# Altium project USB_Hub_Breakout_V3.PrjPcb
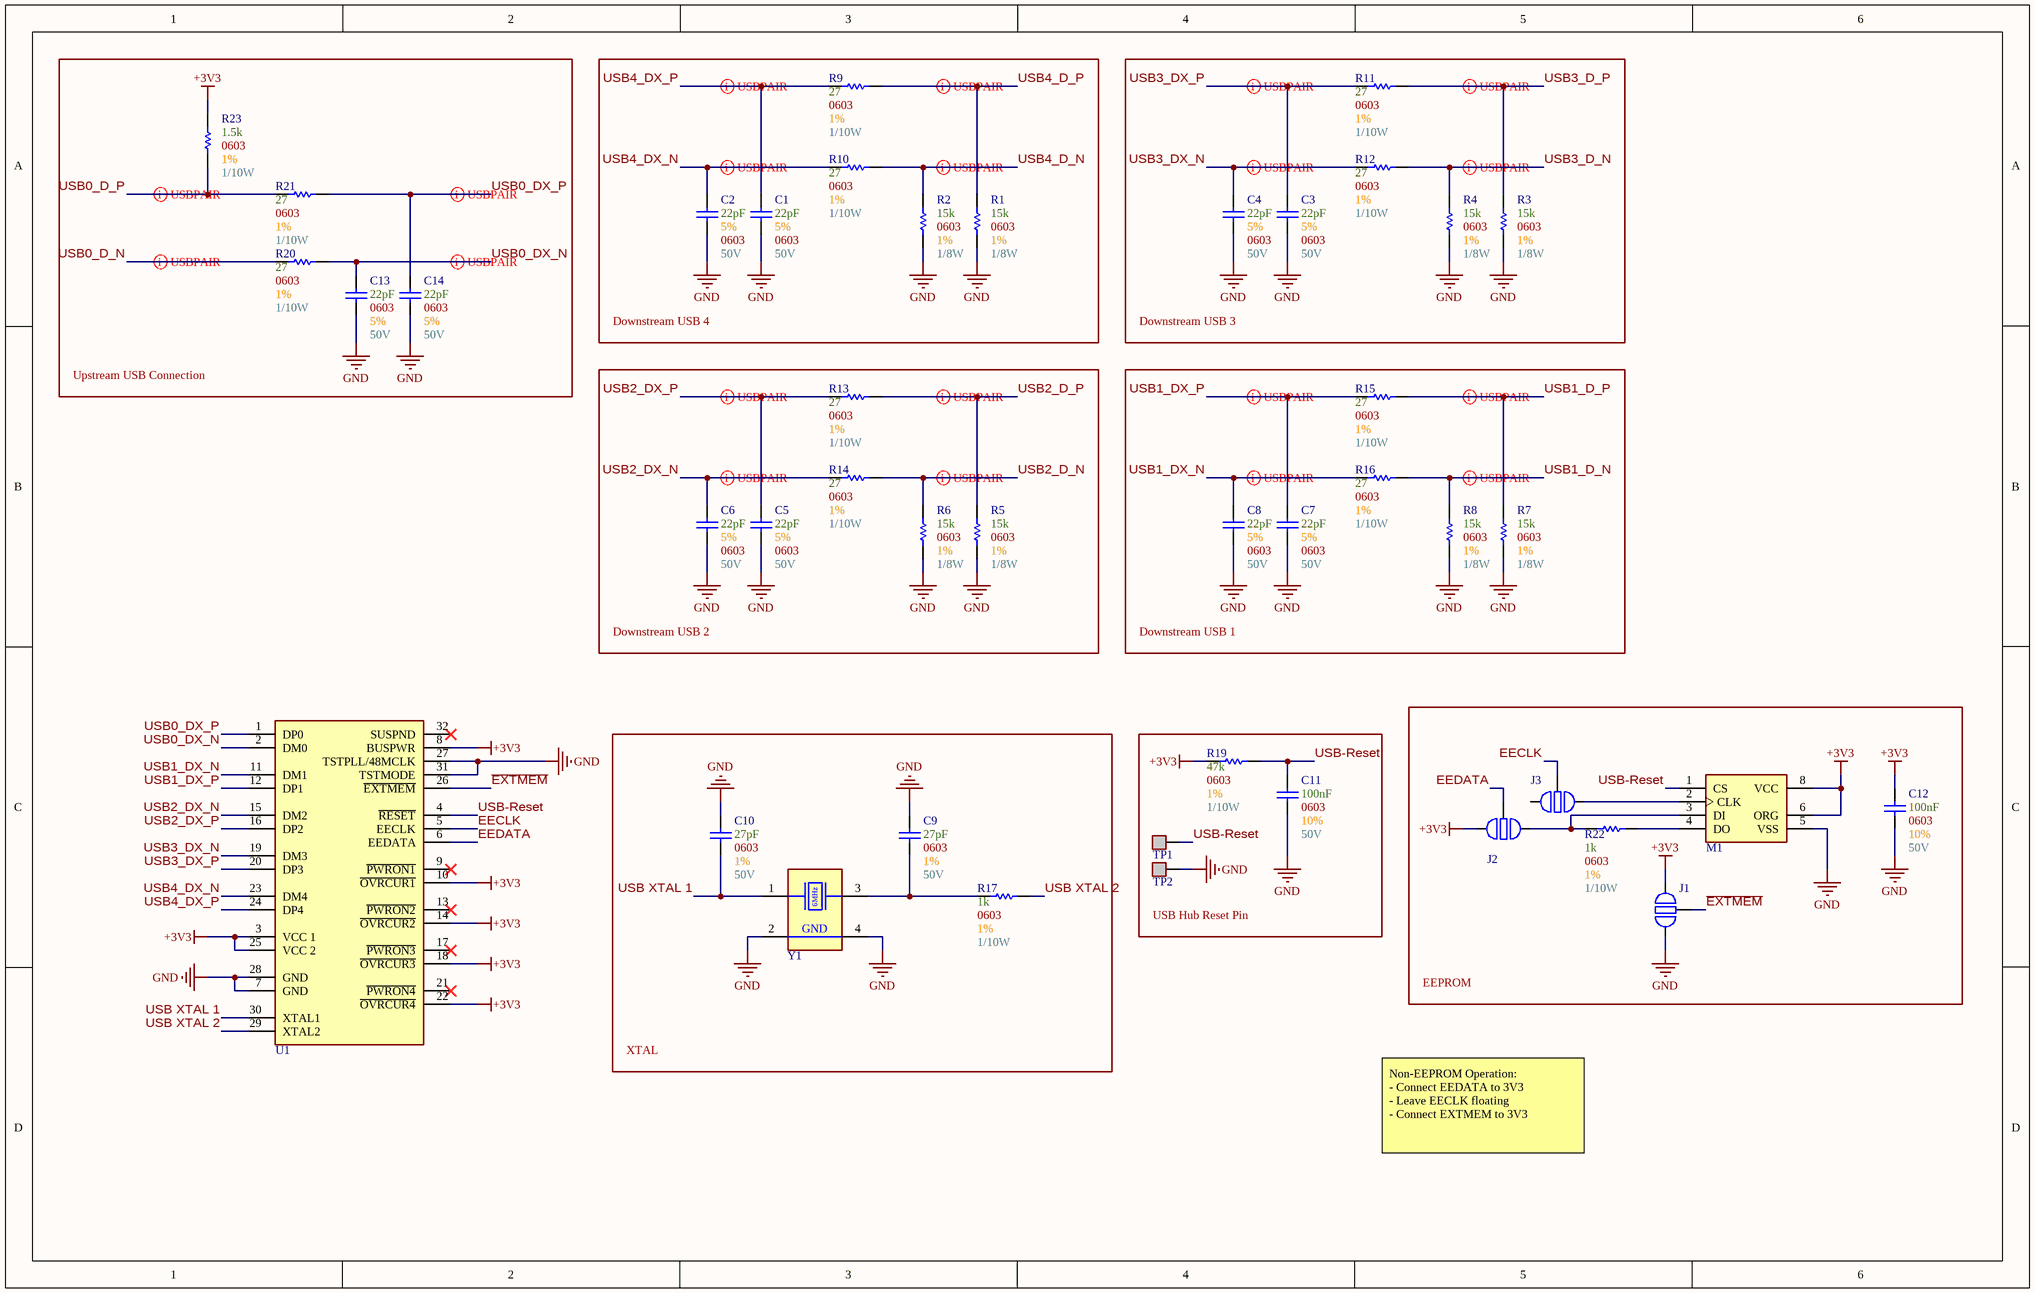
[diagram p0: USB Hub.SchDoc]
3 sheets, 60 parts. Net scope: global (net labels, ports and power ports of the same name join across sheets).
Board file: Layout.PcbDoc
Sheets:
  USB Hub.SchDoc
  Connectors.SchDoc
  Power.SchDoc

## Sheet USB Hub.SchDoc
size B; SheetNumber: 1; SheetTotal: 3

### Parts
C1  Max Voltage: 50V  Size Package: 0603  Tolerance: 5%  Capacitance: 22pF  [[Cap] SMD 0603]  (hidden comment: [Cap] 0603 22pF 5% 50V)
C2  Max Voltage: 50V  Size Package: 0603  Tolerance: 5%  Capacitance: 22pF  [[Cap] SMD 0603]  (hidden comment: [Cap] 0603 22pF 5% 50V)
C3  Max Voltage: 50V  Size Package: 0603  Tolerance: 5%  Capacitance: 22pF  [[Cap] SMD 0603]  (hidden comment: [Cap] 0603 22pF 5% 50V)
C4  Max Voltage: 50V  Size Package: 0603  Tolerance: 5%  Capacitance: 22pF  [[Cap] SMD 0603]  (hidden comment: [Cap] 0603 22pF 5% 50V)
C5  Max Voltage: 50V  Size Package: 0603  Tolerance: 5%  Capacitance: 22pF  [[Cap] SMD 0603]  (hidden comment: [Cap] 0603 22pF 5% 50V)
C6  Max Voltage: 50V  Size Package: 0603  Tolerance: 5%  Capacitance: 22pF  [[Cap] SMD 0603]  (hidden comment: [Cap] 0603 22pF 5% 50V)
C7  Max Voltage: 50V  Size Package: 0603  Tolerance: 5%  Capacitance: 22pF  [[Cap] SMD 0603]  (hidden comment: [Cap] 0603 22pF 5% 50V)
C8  Max Voltage: 50V  Size Package: 0603  Tolerance: 5%  Capacitance: 22pF  [[Cap] SMD 0603]  (hidden comment: [Cap] 0603 22pF 5% 50V)
C9  Max Voltage: 50V  Size Package: 0603  Tolerance: 1%  Capacitance: 27pF  [[Cap] SMD 0603]  (hidden comment: [Cap] 0603 27pF 1% 50V)
C10  Max Voltage: 50V  Size Package: 0603  Tolerance: 1%  Capacitance: 27pF  [[Cap] SMD 0603]  (hidden comment: [Cap] 0603 27pF 1% 50V)
C11  Max Voltage: 50V  Size Package: 0603  Tolerance: 10%  Capacitance: 100nF  [[Cap] SMD 0603]  (hidden comment: [Cap] 0603 0.1uF 10% 50V)
C12  Max Voltage: 50V  Size Package: 0603  Tolerance: 10%  Capacitance: 100nF  [[Cap] SMD 0603]  (hidden comment: [Cap] 0603 0.1uF 10% 50V)
C13  Max Voltage: 50V  Size Package: 0603  Tolerance: 5%  Capacitance: 22pF  [[Cap] SMD 0603]  (hidden comment: [Cap] 0603 22pF 5% 50V)
C14  Max Voltage: 50V  Size Package: 0603  Tolerance: 5%  Capacitance: 22pF  [[Cap] SMD 0603]  (hidden comment: [Cap] 0603 22pF 5% 50V)
J1  [Jumper] Thru-Hole 3pin  [[Jumper] Thru-Hole 3pin]  (value not drawn)  (no BOM)
J2  [Jumper] Thru-Hole 3pin  [[Jumper] Thru-Hole 3pin]  (value not drawn)  (no BOM)
J3  [Jumper] Thru-Hole 3pin  [[Jumper] Thru-Hole 3pin]  (value not drawn)  (no BOM)
M1  [Flash] 32x16b  [[Flash] 32x16b]  (value not drawn)
R1  Wattage: 1/8W  Tolerance: 1%  Resistance: 15k  Size Package: 0603  [[Res] SMD 0603]  (hidden comment: [15k] SMD 0603 1% 1/8W)
R2  Wattage: 1/8W  Tolerance: 1%  Resistance: 15k  Size Package: 0603  [[Res] SMD 0603]  (hidden comment: [15k] SMD 0603 1% 1/8W)
R3  Wattage: 1/8W  Tolerance: 1%  Resistance: 15k  Size Package: 0603  [[Res] SMD 0603]  (hidden comment: [15k] SMD 0603 1% 1/8W)
R4  Wattage: 1/8W  Tolerance: 1%  Resistance: 15k  Size Package: 0603  [[Res] SMD 0603]  (hidden comment: [15k] SMD 0603 1% 1/8W)
R5  Wattage: 1/8W  Tolerance: 1%  Resistance: 15k  Size Package: 0603  [[Res] SMD 0603]  (hidden comment: [15k] SMD 0603 1% 1/8W)
R6  Wattage: 1/8W  Tolerance: 1%  Resistance: 15k  Size Package: 0603  [[Res] SMD 0603]  (hidden comment: [15k] SMD 0603 1% 1/8W)
R7  Wattage: 1/8W  Tolerance: 1%  Resistance: 15k  Size Package: 0603  [[Res] SMD 0603]  (hidden comment: [15k] SMD 0603 1% 1/8W)
R8  Wattage: 1/8W  Tolerance: 1%  Resistance: 15k  Size Package: 0603  [[Res] SMD 0603]  (hidden comment: [15k] SMD 0603 1% 1/8W)
R9  Wattage: 1/10W  Tolerance: 1%  Resistance: 27  Size Package: 0603  [[Res] SMD 0603]  (hidden comment: [27] SMD 0603 1% 1/10W)
R10  Wattage: 1/10W  Tolerance: 1%  Resistance: 27  Size Package: 0603  [[Res] SMD 0603]  (hidden comment: [27] SMD 0603 1% 1/10W)
R11  Wattage: 1/10W  Tolerance: 1%  Resistance: 27  Size Package: 0603  [[Res] SMD 0603]  (hidden comment: [27] SMD 0603 1% 1/10W)
R12  Wattage: 1/10W  Tolerance: 1%  Resistance: 27  Size Package: 0603  [[Res] SMD 0603]  (hidden comment: [27] SMD 0603 1% 1/10W)
R13  Wattage: 1/10W  Tolerance: 1%  Resistance: 27  Size Package: 0603  [[Res] SMD 0603]  (hidden comment: [27] SMD 0603 1% 1/10W)
R14  Wattage: 1/10W  Tolerance: 1%  Resistance: 27  Size Package: 0603  [[Res] SMD 0603]  (hidden comment: [27] SMD 0603 1% 1/10W)
R15  Wattage: 1/10W  Tolerance: 1%  Resistance: 27  Size Package: 0603  [[Res] SMD 0603]  (hidden comment: [27] SMD 0603 1% 1/10W)
R16  Wattage: 1/10W  Tolerance: 1%  Resistance: 27  Size Package: 0603  [[Res] SMD 0603]  (hidden comment: [27] SMD 0603 1% 1/10W)
R17  Wattage: 1/10W  Tolerance: 1%  Resistance: 1k  Size Package: 0603  [[Res] SMD 0603]  (hidden comment: [1k] SMD 0603 1% 1/10W)
R19  Wattage: 1/10W  Tolerance: 1%  Resistance: 47k  Size Package: 0603  [[Res] SMD 0603]  (hidden comment: [47k] SMD 0603 1% 1/10W)
R20  Wattage: 1/10W  Tolerance: 1%  Resistance: 27  Size Package: 0603  [[Res] SMD 0603]  (hidden comment: [27] SMD 0603 1% 1/10W)
R21  Wattage: 1/10W  Tolerance: 1%  Resistance: 27  Size Package: 0603  [[Res] SMD 0603]  (hidden comment: [27] SMD 0603 1% 1/10W)
R22  Wattage: 1/10W  Tolerance: 1%  Resistance: 1k  Size Package: 0603  [[Res] SMD 0603]  (hidden comment: [1k] SMD 0603 1% 1/10W)
R23  Wattage: 1/10W  Tolerance: 1%  Resistance: 1.5k  Size Package: 0603  [[Res] SMD 0603]  (hidden comment: [1.5k] SMD 0603 1% 1/10W)
TP1  [THM] Thru-Hole  [[THM] White]  (value not drawn)
TP2  [THM] Thru-Hole  [[THM] White]  (value not drawn)
U1  4port  [[USB Hub] USB2.0 4port]  (value not drawn)
Y1  [Crystal] SMD 6MHz  [[Crystal] SMD 6MHz]  (value not drawn)

### Blocks framed on the sheet
Upstream USB Connection: C13 C14 R20 R21 R23
Downstream USB 4: C1 C2 R1 R2 R9 R10
Downstream USB 3: C3 C4 R3 R4 R11 R12
Downstream USB 2: C5 C6 R5 R6 R13 R14
Downstream USB 1: C7 C8 R7 R8 R15 R16
EEPROM: C12 J1-J3 M1 R22
XTAL: C9 C10 R17 Y1
USB Hub Reset Pin: C11 R19 TP1 TP2

### Nets
+3V3: C12.2 J1.3 J2.3 M1.6(ORG) M1.8(VCC) R19.1 R23.2 U1.3(VCC_1) U1.8(BUSPWR) U1.10(~{OVRCUR1}) U1.14(~{OVRCUR2}) U1.18(~{OVRCUR3}) U1.22(~{OVRCUR4}) U1.25(VCC_2)
GND: C1.1 C2.1 C3.1 C4.1 C5.1 C6.1 C7.1 C8.1 C9.1 C10.1 C11.1 C12.1 C13.1 C14.1 J1.1 M1.5(VSS) R1.1 R2.1 R3.1 R4.1 R5.1 R6.1 R7.1 R8.1 TP2.1 U1.7(GND) U1.27(TSTPLL/48MCLK) U1.28(GND) U1.31(TSTMODE) Y1.2(GND) Y1.4(GND)
~{EXTMEM}: J1.2(Common) U1.26(~{EXTMEM})
EECLK: J3.2(Common) U1.5(EECLK)
EEDATA: J2.2(Common) U1.6(EEDATA)
USB0_D_N: R20.1
USB0_D_P: R21.1 R23.1
USB0_DX_N: C13.2 R20.2 U1.2(DM0)
USB0_DX_P: C14.2 R21.2 U1.1(DP0)
USB1_D_N: R8.2 R16.2
USB1_D_P: R7.2 R15.2
USB1_DX_N: C8.2 R16.1 U1.11(DM1)
USB1_DX_P: C7.2 R15.1 U1.12(DP1)
USB2_D_N: R6.2 R14.2
USB2_D_P: R5.2 R13.2
USB2_DX_N: C6.2 R14.1 U1.15(DM2)
USB2_DX_P: C5.2 R13.1 U1.16(DP2)
USB3_D_N: R4.2 R12.2
USB3_D_P: R3.2 R11.2
USB3_DX_N: C4.2 R12.1 U1.19(DM3)
USB3_DX_P: C3.2 R11.1 U1.20(DP3)
USB4_D_N: R2.2 R10.2
USB4_D_P: R1.2 R9.2
USB4_DX_N: C2.2 R10.1 U1.23(DM4)
USB4_DX_P: C1.2 R9.1 U1.24(DP4)
USB XTAL 1: C10.2 U1.30(XTAL1) Y1.1(XTAL1)
USB XTAL 2: R17.2 U1.29(XTAL2)
USB-Reset: C11.2 M1.1(CS) R19.2 TP1.1 U1.4(~{RESET})
NetC9_2: C9.2 R17.1 Y1.3(XTAL2)
NetJ2_1: J2.1 M1.3(DI) R22.2
NetJ3_1: J3.1 M1.2(CLK)
NetM1_4: M1.4(DO) R22.1

Not connected (* = marked no-connect by the designer): J3 3; U1 9(~{PWRON1})* 13(~{PWRON2})* 17(~{PWRON3})* 21(~{PWRON4})* 32(SUSPND)*

### Layout directives
differential pair; differential pair class USB_Pairs: USB0_D_N, USB0_D_P, USB0_DX_N, USB0_DX_P, USB1_D_N, USB1_D_P, USB1_DX_N, USB1_DX_P, USB2_D_N, USB2_D_P, USB2_DX_N, USB2_DX_P, USB3_D_N, USB3_D_P, USB3_DX_N, USB3_DX_P, USB4_D_N, USB4_D_P, USB4_DX_N, USB4_DX_P

### Notes on the sheet
- Non-EEPROM Operation:
  - Connect EEDATA to 3V3
  - Leave EECLK floating
  - Connect EXTMEM to 3V3
- (in symbol [Crystal] SMD 6MHz) 6MHz

### Library data of the parts
C1-C8 C13 C14 = [Cap] 0603 22pF 5% 50V: CC0603JRNPO9BN240; Supplier 1: DigiKey; Supplier Part Number 1: 311-1062-1-ND
C9 C10 = [Cap] 0603 27pF 1% 50V: 0603N270F500CT; Supplier 1: DigiKey; Supplier Part Number 1: 1292-1510-1-ND
C11 C12 = [Cap] 0603 0.1uF 10% 50V: CL10B104KB8NNNC; Supplier 1: DigiKey; Supplier Part Number 1: 1276-1000-6-ND
M1 = [Flash] 32x16b: M93C46-WMN6TP; Supplier 1: DigiKey; Supplier Part Number 1: 497-5090-1-ND
R1-R8 = [15k] SMD 0603 1% 1/8W: CRCW060315K0FKEA; Supplier 1: DigiKey; Supplier Part Number 1: 541-15.0KHCT-ND
R9-R16 R20 R21 = [27] SMD 0603 1% 1/10W: MCT06030C2709FP500; Supplier 1: DigiKey; Supplier Part Number 1: 749-1631-1-ND
R17 R22 = [1k] SMD 0603 1% 1/10W: RMCF0603FT1K00; Supplier 1: DigiKey; Supplier Part Number 1: RMCF0603FT1K00DKR-ND
R19 = [47k] SMD 0603 1% 1/10W: RC0603FR-0747KL; Supplier 1: DigiKey; Supplier Part Number 1: 311-47.0KHRDKR-ND
R23 = [1.5k] SMD 0603 1% 1/10W: CR0603-FX-1501ELF; Supplier 1: DigiKey; Supplier Part Number 1: 118-CR0603-FX-1501ELFCT-ND
TP1 TP2 = [THM] Thru-Hole: 5012; Supplier 1: DigiKey; Supplier Part Number 1: 36-5012-ND
U1 = [USB Hub] USB 2.0 4port: TUSB2046BVFR; Supplier 1: DigiKey; Supplier Part Number 1: 296-27131-1-ND
Y1 = [Crystal] SMD 6MHz: ECS-060-18-20BM-JEN-TR; Supplier 1: DigiKey; Supplier Part Number 1: XC2349DKR-ND

## Sheet Connectors.SchDoc
size A; SheetNumber: 2; SheetTotal: 3
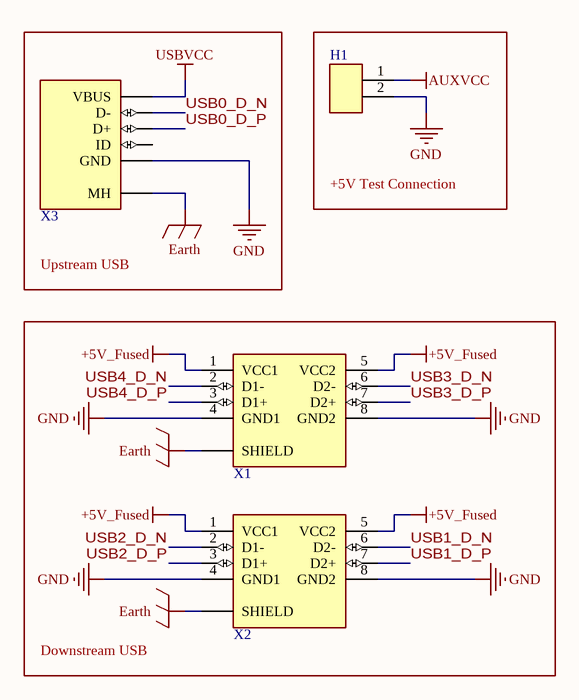
[diagram p1: Connectors.SchDoc]

### Parts
H1  1x2 Header  [[Header] 1x2 Male]  (value not drawn)
X1  USB-A  [[USB] Type-A Dual]  (value not drawn)
X2  USB-A  [[USB] Type-A Dual]  (value not drawn)
X3  [USB] Type-B Mini  [[USB] Type-B Mini]  (value not drawn)

### Blocks framed on the sheet
Upstream USB: X3
+5V Test Connection: H1
Downstream USB: X1 X2

### Nets
+5V_Fused: X1.1(VCC1) X1.5(VCC2) X2.1(VCC1) X2.5(VCC2)
AUXVCC: H1.1
Earth: X1.MH(SHIELD) X2.MH(SHIELD) X3.MH
GND: H1.2 X1.4(GND1) X1.8(GND2) X2.4(GND1) X2.8(GND2) X3.5(GND)
USBVCC: X3.1(VBUS)
USB0_D_N: X3.2(D-)
USB0_D_P: X3.3(D+)
USB1_D_N: X2.6(D2-)
USB1_D_P: X2.7(D2+)
USB2_D_N: X2.2(D1-)
USB2_D_P: X2.3(D1+)
USB3_D_N: X1.6(D2-)
USB3_D_P: X1.7(D2+)
USB4_D_N: X1.2(D1-)
USB4_D_P: X1.3(D1+)

Not connected (* = marked no-connect by the designer): X3 4(ID)

### Library data of the parts
H1 = [Header] 1x2 Male: 2.54mm pitch
X1 X2 = [USB] Type-A Dual: 61400826021; Supplier 1: DigiKey; Supplier Part Number 1: 2092-KUSBX-AS2N-B-ND
X3 = [USB] Type-B Mini: MUSB-05-S-B-SM-A-K-TR; Supplier 1: DigiKey; Supplier Part Number 1: SAM14226CT-ND

## Sheet Power.SchDoc
size A; SheetNumber: 3; SheetTotal: 3
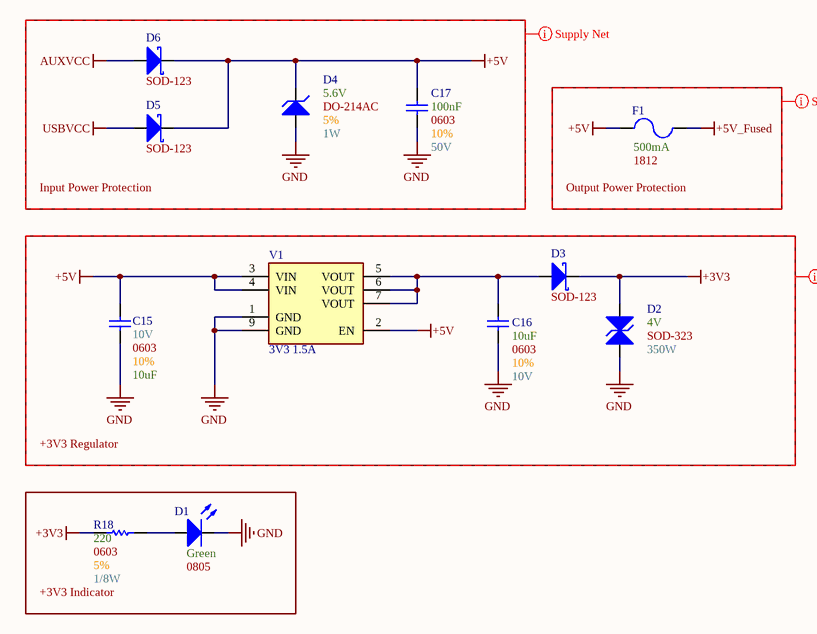
[diagram p2: Power.SchDoc]

### Parts
C15  Max Voltage: 10V  Size Package: 0603  Tolerance: 10%  Capacitance: 10uF  [[Cap] SMD 0603]  (hidden comment: [Cap] 0603 10uF 10% 10V)
C16  Max Voltage: 10V  Size Package: 0603  Tolerance: 10%  Capacitance: 10uF  [[Cap] SMD 0603]  (hidden comment: [Cap] 0603 10uF 10% 10V)
C17  Max Voltage: 50V  Size Package: 0603  Tolerance: 10%  Capacitance: 100nF  [[Cap] SMD 0603]  (hidden comment: [Cap] 0603 0.1uF 10% 50V)
D1  Color: Green  Size Package: 0805  [[LED] SMD 0805]  (hidden comment: [LED] SMD 0805 Green)
D2  Wattage: 350W  Optimal Zener Voltage: 4V  [[Diode] SOD-323]  (hidden comment: SOD-323)
D3  Footprint: SOD-123  [[Diode] SMD SOD-123]  (hidden comment: SOD123)
D4  Tolerance: 5%  Wattage: 1W  Optimal Zener Voltage: 5.6V  [[Diode] SMD DO-214AC]  (hidden comment: DO-214AC)
D5  Footprint: SOD-123  [[Diode] SMD SOD-123]  (hidden comment: SOD123)
D6  Footprint: SOD-123  [[Diode] SMD SOD-123]  (hidden comment: SOD123)
F1  Size Package: 1812  Trip Current: 500mA  [[PTC] SMD 1812]  (hidden comment: [PTC] SMD 1812 500mA)
R18  Wattage: 1/8W  Tolerance: 5%  Resistance: 220  Size Package: 0603  [[Res] SMD 0603]  (hidden comment: [220] SMD 0603 5% 1/10W)
V1  3V3 1.5A  [[Linear] 3V3 1.5A]

### Blocks framed on the sheet
Input Power Protection: C17 D4-D6
Output Power Protection: F1
+3V3 Regulator: C15 C16 D2 D3 V1
+3V3 Indicator: D1 R18

### Nets
+3V3: D2.1(K) D3.1(K) R18.1
+5V: C15.2 C17.2 D4.1(K) D5.1(K) D6.1(K) F1.1 V1.2(EN) V1.3(VIN) V1.4(VIN)
+5V_Fused: F1.2
AUXVCC: D6.2(A)
GND: C15.1 C16.1 C17.1 D1.2(Cathode) D2.2(A) D4.2(A) V1.1(GND) V1.9(GND)
USBVCC: D5.2(A)
NetC16_2: C16.2 D3.2(A) V1.5(VOUT) V1.6(VOUT) V1.7(VOUT)
NetD1_1: D1.1(Anode) R18.2

### Layout directives
net class Supply_Nets: +3V3, +5V, +5V_Fused, AUXVCC, GND, USBVCC

### Library data of the parts
C15 C16 = [Cap] 0603 10uF 10% 10V: CL10A106KP8NNNC; Supplier 1: DigiKey; Supplier Part Number 1: 1276-1192-6-ND
C17 = [Cap] 0603 0.1uF 10% 50V: CL10B104KB8NNNC; Supplier 1: DigiKey; Supplier Part Number 1: 1276-1000-6-ND
D1 = [LED] SMD 0805 Green: LG R971-KN-1-0-20-R18; Supplier 1: DigiKey; Supplier Part Number 1: 475-LGR971-KN-1CT-ND
D2 = [TVS] 3.3Vnom 19Vclamp_max: CDSOD323-T03C; Supplier 1: DigiKey; Footprint: SOD-323; Supplier Part Number 1: CDSOD323-T03CDKR-ND
D3 D5 D6 = [Schottky] SMD 40V 1A: B5819W-TP; Supplier 1: DigiKey; Supplier Part Number 1: B5819W-TPMSCT-ND
D4 = [Zener] SMD 5.6V 1W 5%: SMAZ5V6-13-F; Supplier 1: DigiKey; Supplier Part Number 1: SMAZ5V6-FDICT-ND; Footprint: DO-214AC
F1 = [PTC] SMD 1812 500mA: MF-MSMF050-2; Supplier 1: DigiKey; Supplier Part Number 1: MF-MSMF050-2DKR-ND
R18 = [220] SMD 0603 5% 1/10W: RK73B1JTTD221J; Supplier 1: DigiKey; Supplier Part Number 1: 2019-RK73B1JTTD221JDKR-ND
V1 = [Linear] SMD 3V3 1.5A: AP7362A-33SP-13; Supplier 1: DigiKey; Supplier Part Number 1: AP7362A-33SP-13DICT-ND

## Nets that join several sheets
+3V3: USB Hub (14 pins), Power (D2.1 D3.1 R18.1)
+5V_Fused: Connectors (X1.1 X1.5 X2.1 X2.5), Power (F1.2)
AUXVCC: Connectors (H1.1), Power (D6.2)
GND: USB Hub (31 pins), Connectors (6 pins), Power (8 pins)
USBVCC: Connectors (X3.1), Power (D5.2)
USB0_D_N: USB Hub (R20.1), Connectors (X3.2)
USB0_D_P: USB Hub (R21.1 R23.1), Connectors (X3.3)
USB1_D_N: USB Hub (R8.2 R16.2), Connectors (X2.6)
USB1_D_P: USB Hub (R7.2 R15.2), Connectors (X2.7)
USB2_D_N: USB Hub (R6.2 R14.2), Connectors (X2.2)
USB2_D_P: USB Hub (R5.2 R13.2), Connectors (X2.3)
USB3_D_N: USB Hub (R4.2 R12.2), Connectors (X1.6)
USB3_D_P: USB Hub (R3.2 R11.2), Connectors (X1.7)
USB4_D_N: USB Hub (R2.2 R10.2), Connectors (X1.2)
USB4_D_P: USB Hub (R1.2 R9.2), Connectors (X1.3)